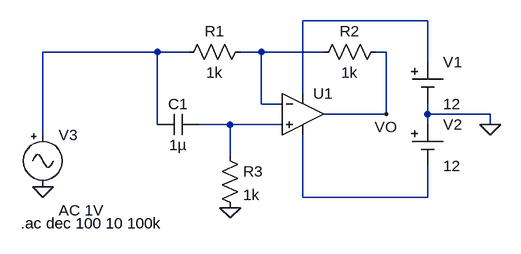
[diagram p0: schematic TPS1-Pasatodo.asc]
TPS1-Pasatodo.asc, the LTspice schematic file:
Version 4
SHEET 1 880 680
WIRE 432 80 240 80
WIRE 16 128 -160 128
WIRE 64 128 16 128
WIRE 176 128 144 128
WIRE 272 128 176 128
WIRE 368 128 352 128
WIRE 432 144 432 80
WIRE 240 192 240 80
WIRE 176 208 176 128
WIRE 208 208 176 208
WIRE 368 224 368 128
WIRE 368 224 272 224
WIRE 432 224 432 208
WIRE 528 224 432 224
WIRE 16 240 16 128
WIRE 128 240 80 240
WIRE 208 240 128 240
WIRE 432 240 432 224
WIRE 528 240 528 224
WIRE -160 256 -160 128
WIRE 128 288 128 240
WIRE 240 352 240 256
WIRE 432 352 432 304
WIRE 432 352 240 352
FLAG 528 240 0
FLAG 368 224 VO
FLAG 128 368 0
FLAG -160 336 0
SYMBOL Opamps\\UniversalOpamp2 240 224 R0
SYMATTR InstName U1
SYMBOL Misc\\cell 432 144 R0
WINDOW 123 0 0 Left 0
WINDOW 39 0 0 Left 0
SYMATTR InstName V1
SYMATTR Value 12
SYMBOL Misc\\cell 432 240 R0
WINDOW 123 0 0 Left 0
WINDOW 39 0 0 Left 0
SYMATTR InstName V2
SYMATTR Value 12
SYMBOL res 160 112 R90
WINDOW 0 0 56 VBottom 2
WINDOW 3 32 56 VTop 2
SYMATTR InstName R1
SYMATTR Value 1k
SYMBOL res 368 112 R90
WINDOW 0 0 56 VBottom 2
WINDOW 3 32 56 VTop 2
SYMATTR InstName R2
SYMATTR Value 1k
SYMBOL res 112 272 R0
SYMATTR InstName R3
SYMATTR Value 1k
SYMBOL cap 80 224 R90
WINDOW 0 0 32 VBottom 2
WINDOW 3 32 32 VTop 2
SYMATTR InstName C1
SYMATTR Value 1µ
SYMBOL Misc\\signal -160 240 R0
WINDOW 123 24 132 Left 2
WINDOW 39 0 0 Left 0
SYMATTR InstName V3
SYMATTR Value ""
SYMATTR Value2 AC 1V
TEXT -194 392 Left 2 !.ac dec 100 10 100k

The netlist it stands for:
* TPS1-Pasatodo.asc
XU1 N004 N003 N001 N005 VO level.2 Avol=1Meg GBW=10Meg Slew=10Meg ilimit=25m rail=0 Vos=0 phimargin=45 en=0 enk=0 in=0 ink=0 Rin=500Meg  ; pins IN+ IN- V+ V- OUT
V1 N001 0 12
V2 0 N005 12
R1 N003 N002 1k
R2 VO N003 1k
R3 N004 0 1k
C1 N004 N002 1µ
V3 N002 0 AC 1V
.ac dec 100 10 100k
.lib UniversalOpamps2.sub
.backanno
.end